# Altium schematic sheet 01_Power.SchDoc
size OrCAD B
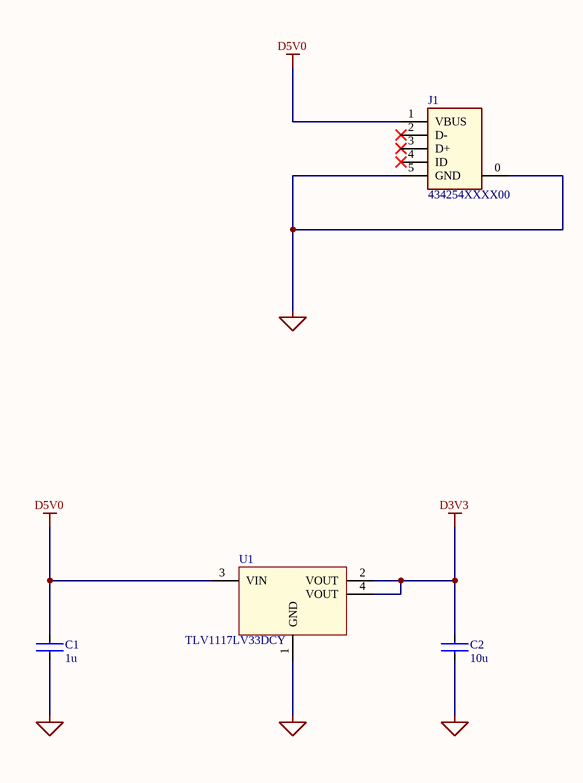
[diagram p0: 01_Power.SchDoc]

## Parts
C1  1u  [CAPC1608X09N_C0603]
C2  10u  [CAPC1608X09N_C0603]
J1  434254XXXX00  [434254XXXX00]
U1  TLV1117LV33DCY  [SOT230P700X180-4N_SOT223_TLV1117LV]

## Nets
D3V3: C2.1 U1.2(VOUT) U1.4(VOUT)
D5V0: C1.1 J1.1(VBUS) U1.3(VIN)
GND: C1.2 C2.2 J1.0 J1.5(GND) U1.1(GND)

Not connected (* = marked no-connect by the designer): J1 2(D-)* 3(D+)* 4(ID)*

## Library data of the parts
C1 = CAP12: CAP,Ceramic,X7R,10%,16V,1uF,0603; Manufacturer1: *; Manufacturer2: *; PartNumberManufacturer1: *; UnitPrice: *; Value: 1u
C2 = CAP113: CAP,Ceramic,X7R,10%,6.3V,10uF,0603; Manufacturer1: *; Manufacturer2: *; PartNumberManufacturer1: *; UnitPrice: *; Value: 10u
J1 = 434254XXXX00: Mini-USB Receptacle,5-Pin,0.8mm Pitch,SMD; Manufacturer1: Leyconn; Manufacturer2: *; PartNumberManufacturer1: 434254XXXX00; PartNumberManufacturer2: *; UnitPrice: *
U1 = TLV1117LV33DCY: IC,LDO,1000mA,3.3V,SOT223; Manufacturer1: Ti; Manufacturer2: *; PartNumberManufacturer1: TLV1117LV33DCY; PartNumberManufacturer2: *; UnitPrice: *